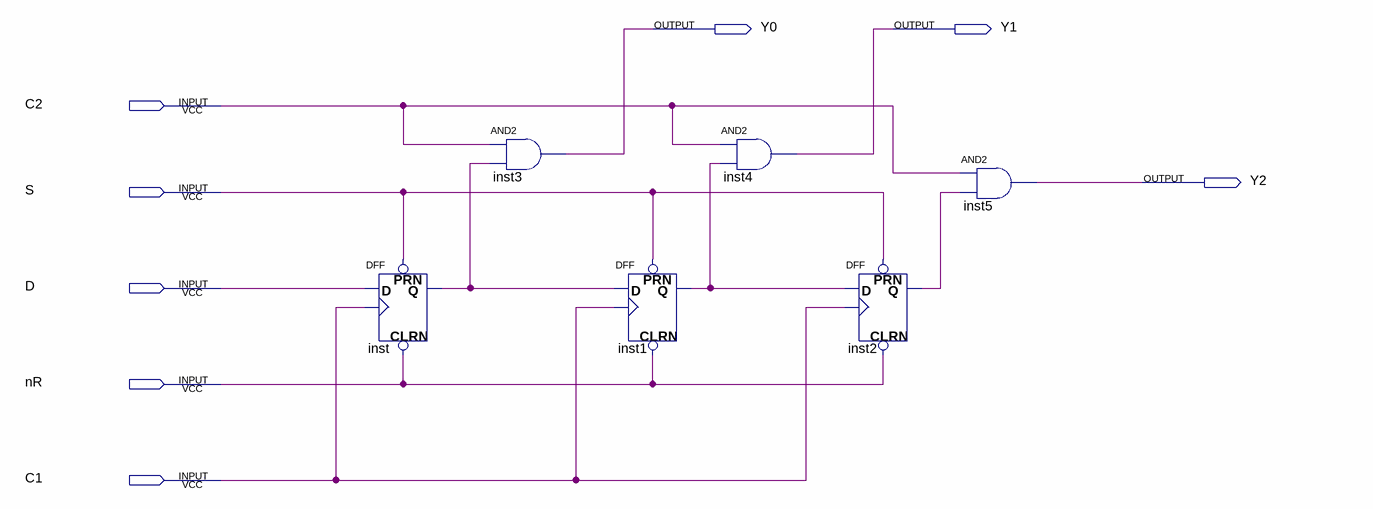
[diagram p0: schematic sheet]
// Quartus schematic SeqParReg.bdf as structural Verilog: 6 symbols, 8 pins
module SeqParReg (
  input  C2,
  input  S,
  input  D,
  input  nR,
  input  C1,
  output Y0,
  output Y1,
  output Y2
);

  wire inst1_q, inst2_q, inst_q;

  DFF inst (.CLRN(nR), .CLK(C1), .D(D), .PRN(S), .Q(inst_q));
  and inst3 (Y0, C2, inst_q);
  DFF inst1 (.CLRN(nR), .CLK(C1), .D(inst_q), .PRN(S), .Q(inst1_q));
  and inst4 (Y1, C2, inst1_q);
  DFF inst2 (.CLRN(nR), .CLK(C1), .D(inst1_q), .PRN(S), .Q(inst2_q));
  and inst5 (Y2, C2, inst2_q);
endmodule
